# EAGLE design Example (EAGLE 7.7.0)
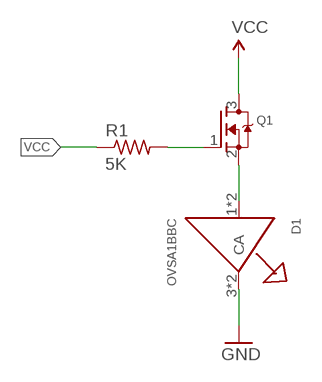
[diagram p0: schematic, sheet 1]

## Parts
D1  OVSA1BBC  [4-PLCC]
Q1  MOSFET-NREFLOW  [SOT23]
R1  5K  R-US_M0805  [M0805]

## Nets
DRIN: D1.1(A) D1.2(A) Q1.2(S)
GATE: Q1.1(G) R1.2
GND: D1.3(C) D1.4(C)
VCC: Q1.3(D) R1.1

## Library data of the parts
D1 = TTelectronics:OVSA1BBC
Q1 = adafruit:MOSFET-N: N-Channel Mosfet 2N7002E - 60V 260mA SOT23 [Digikey: 2N7002ET1GOSTR-ND] - REEL BSH103 - 30V 850mA SOT23 [Digikey: 568-5013-1-ND]
R1 = adafruit:R-US_: RESISTOR, American symbol

## Board
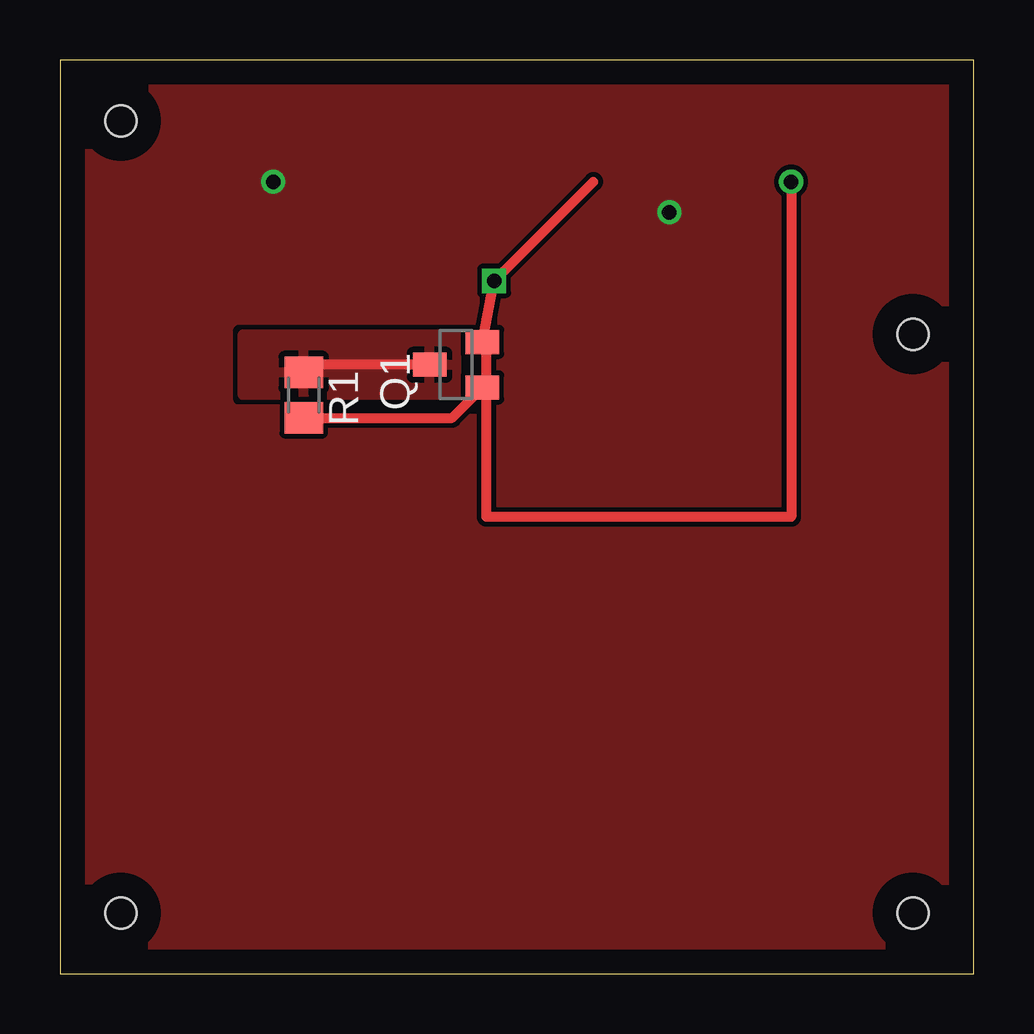
[diagram p1: board, top side]
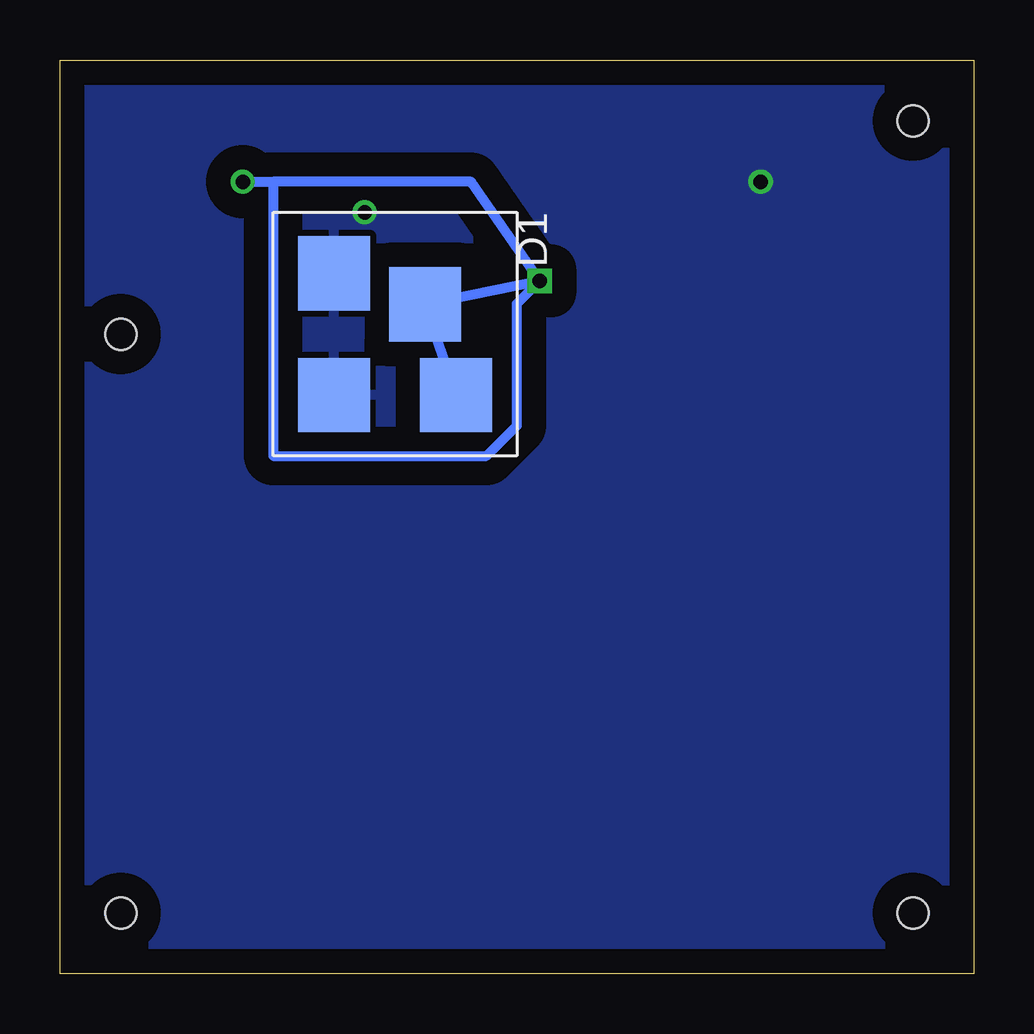
[diagram p2: board, bottom side, seen from below]

Size 38.1 x 38.1 mm. Coordinates in mm from the lower left corner, seen from the top.
Outline: 0,0 38.1,0 38.1,38.1 0,38.1 0,0
Copper layers (1*16): Top 0.035mm / dielectric 1.5mm / Bottom 0.035mm
Design rules "default": minimum track width 10mil, minimum drill 24mil, track to track 8mil, track to pad 8mil, pad to pad 8mil, via to via 8mil, smd to smd 8mil, copper to edge 40mil, drill to drill 8mil, minimum pad ring 10mil, minimum via ring 8mil, stop-mask expansion 4mil, vias tented up to drill 0mil, thermal gap 10mil
Holes 1.3 mm at 2.54,35.56 2.54,2.54 35.56,2.54 35.56,26.67

### Footprints (pad centres in the part's own frame; a part is rotated, then mirrored left to right if it is on the bottom)
4-PLCC = smd 3.1 x 3: 1 -1.24,1.24; 2 2.54,2.54; 3 2.54,-2.54; 4 -2.54,-2.54
SOT23 = smd 1 x 1.4: 1 -0.95,-1.1; 2 0.95,-1.1; 3 0,1.1
M0805 = smd 1.3 x 1.6: 1 -0.95,0; 2 0.95,0

### Placement (x,y rotation side)
D1  24.13,26.67 270 bottom
Q1  16.51,25.4 90 top
R1  10.16,24.13 270 top

### Tracks (layer width: path | path; a pad name or v marks a point on that pad's centre or on a via)
DRIN  (via drill 0.6)
  Top 0.406: Q1.2 v18.1,28.89 22.23,33.02 | v30.48,33.02 30.48,19.05 17.78,19.05 17.78,26.67
  Bottom 0.406: D1.2 D1.1 v18.1,28.89 20.96,33.02 29.21,33.02 | 29.21,33.02 29.21,21.59 20.32,21.59 19.05,22.86 19.05,27.94 17.78,29.21 | v30.48,33.02 29.21,33.02
GATE
  Top 0.406: R1.2 16.34,23.18 Q1.1
GND  (via drill 0.6)
  other vias: 8.89,33.02 25.4,31.75
  pour Top (rank 6): 0,0 38.1,0 38.1,38.1 0,38.1
  pour Bottom (isolate 1.016): 0,0 38.1,0 38.1,38.1 0,38.1
VCC
  Top 0.406: Q1.3 10.48,25.4 R1.1
  pour Top: 7.62,26.67 16.51,26.67 16.51,24.13 7.62,24.13